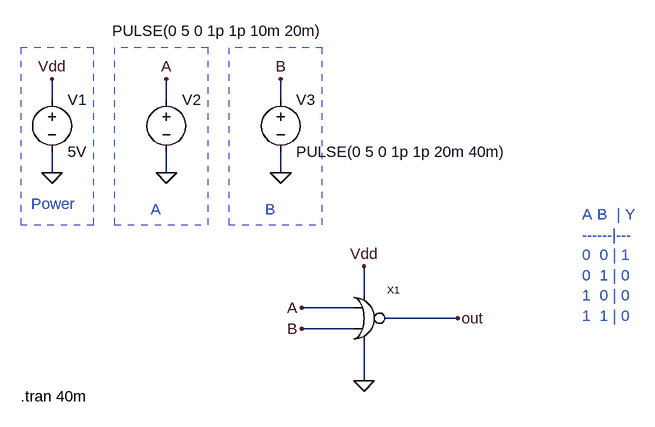
[diagram p0: schematic nor_block.asc]
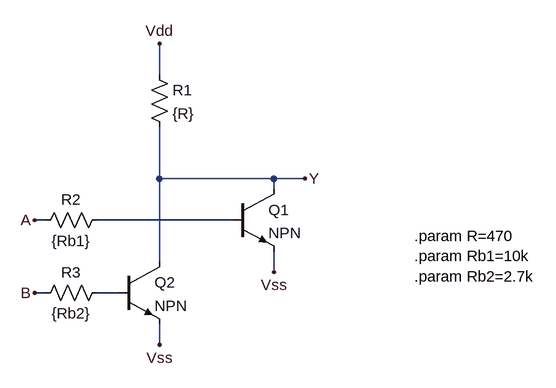
[diagram p1: sub-circuit nor.asc]
nor_block.asc, the LTspice schematic file:
Version 4
SHEET 1 880 680
WIRE -560 -416 -560 -448
WIRE -384 -416 -384 -448
WIRE -208 -416 -208 -448
WIRE -560 -304 -560 -336
WIRE -384 -304 -384 -336
WIRE -208 -304 -208 -336
WIRE -80 -112 -80 -160
WIRE -96 -96 -176 -96
WIRE 64 -80 -48 -80
WIRE -96 -64 -176 -64
WIRE -80 16 -80 -48
FLAG 64 -80 out
FLAG -176 -96 A
FLAG -80 -160 Vdd
FLAG -80 16 0
FLAG -560 -304 0
FLAG -560 -448 Vdd
FLAG -384 -304 0
FLAG -384 -448 A
FLAG -176 -64 B
FLAG -208 -304 0
FLAG -208 -448 B
SYMBOL voltage -560 -432 R0
WINDOW 123 0 0 Left 0
WINDOW 39 0 0 Left 0
SYMATTR InstName V1
SYMATTR Value 5V
SYMBOL voltage -384 -432 R0
WINDOW 123 0 0 Left 0
WINDOW 39 0 0 Left 0
WINDOW 3 -83 -90 Left 2
SYMATTR InstName V2
SYMATTR Value PULSE(0 5 0 1p 1p 10m 20m)
SYMBOL voltage -208 -432 R0
WINDOW 123 0 0 Left 0
WINDOW 39 0 0 Left 0
SYMATTR InstName V3
SYMATTR Value PULSE(0 5 0 1p 1p 20m 40m)
SYMBOL nor -112 -48 R0
SYMATTR InstName X1
TEXT -592 -256 Left 2 ;Power
TEXT -408 -248 Left 2 ;A
TEXT -608 40 Left 2 !.tran 40m
TEXT -232 -248 Left 2 ;B
TEXT 256 -240 Left 2 ;A B  | Y\n------|---\n0  0 | 1\n0  1 | 0\n1  0 | 0\n1  1 | 0
RECTANGLE Normal -496 -496 -608 -224 2
RECTANGLE Normal -320 -496 -464 -224 2
RECTANGLE Normal -144 -496 -288 -224 2

nor.asc, the sub-circuit schematic file:
Version 4
SHEET 1 880 680
WIRE -544 -224 -544 -272
WIRE -544 -64 -544 -144
WIRE -368 -64 -544 -64
WIRE -320 -64 -368 -64
WIRE -368 -48 -368 -64
WIRE -720 0 -736 0
WIRE -432 0 -640 0
WIRE -544 64 -544 -64
WIRE -368 80 -368 48
WIRE -720 112 -736 112
WIRE -608 112 -640 112
WIRE -544 192 -544 160
FLAG -320 -64 Y
FLAG -544 192 Vss
FLAG -544 -272 Vdd
FLAG -736 112 B
FLAG -736 0 A
FLAG -368 80 Vss
SYMBOL npn -432 -48 R0
SYMATTR InstName Q1
SYMBOL npn -608 64 R0
SYMATTR InstName Q2
SYMBOL res -560 -240 R0
SYMATTR InstName R1
SYMATTR Value {R}
SYMBOL res -624 -16 R90
WINDOW 0 0 56 VBottom 2
WINDOW 3 32 56 VTop 2
SYMATTR InstName R2
SYMATTR Value {Rb1}
SYMBOL res -624 96 R90
WINDOW 0 0 56 VBottom 2
WINDOW 3 32 56 VTop 2
SYMATTR InstName R3
SYMATTR Value {Rb2}
TEXT -152 24 Left 2 !.param R=470\n.param Rb1=10k\n.param Rb2=2.7k

The netlist it stands for:
* nor_block.asc
V1 Vdd 0 5V
V2 A 0 PULSE(0 5 0 1p 1p 10m 20m)
V3 B 0 PULSE(0 5 0 1p 1p 20m 40m)
XX1 A B out Vdd 0 nor

* block symbol definitions
.subckt nor A B Y Vdd Vss
Q1 Y N001 Vss 0 NPN
Q2 Y N002 Vss 0 NPN
R1 Vdd Y {R}
R2 N001 A {Rb1}
R3 N002 B {Rb2}
.param R=470
.param Rb1=10k
.param Rb2=2.7k
.ends nor

.model NPN NPN
.model PNP PNP
.lib standard.bjt
* Power
* A
.tran 40m
* B
* A B  | Y
* ------|---
* 0  0 | 1
* 0  1 | 0
* 1  0 | 0
* 1  1 | 0
.backanno
.end